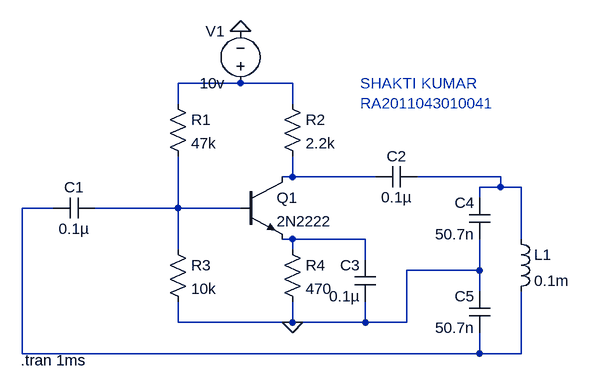
[diagram p0: schematic exp 8.asc]
exp 8.asc, the LTspice schematic file:
Version 4
SHEET 1 880 680
WIRE 192 0 96 0
WIRE 272 0 192 0
WIRE 96 32 96 0
WIRE 272 32 272 0
WIRE 272 144 272 112
WIRE 272 144 256 144
WIRE 400 144 272 144
WIRE 592 144 464 144
WIRE 592 160 592 144
WIRE 592 160 560 160
WIRE 624 160 592 160
WIRE 560 176 560 160
WIRE -96 192 -144 192
WIRE 96 192 96 112
WIRE 96 192 -32 192
WIRE 192 192 96 192
WIRE 272 240 256 240
WIRE 384 240 272 240
WIRE 624 240 624 160
WIRE 96 256 96 192
WIRE 272 256 272 240
WIRE 384 272 384 240
WIRE 560 288 560 240
WIRE 560 288 448 288
WIRE 560 320 560 288
WIRE 96 368 96 336
WIRE 272 368 272 336
WIRE 272 368 96 368
WIRE 384 368 384 336
WIRE 384 368 272 368
WIRE 448 368 448 288
WIRE 448 368 384 368
WIRE -144 416 -144 192
WIRE 560 416 560 384
WIRE 560 416 -144 416
WIRE 624 416 624 320
WIRE 624 416 560 416
FLAG 192 -80 0
FLAG 272 368 0
SYMBOL res 80 16 R0
SYMATTR InstName R1
SYMATTR Value 47k
SYMBOL res 256 16 R0
SYMATTR InstName R2
SYMATTR Value 2.2k
SYMBOL res 80 240 R0
SYMATTR InstName R3
SYMATTR Value 10k
SYMBOL res 256 240 R0
SYMATTR InstName R4
SYMATTR Value 470
SYMBOL npn 192 144 R0
SYMATTR InstName Q1
SYMATTR Value 2N2222
SYMBOL cap -32 176 R90
WINDOW 0 0 32 VBottom 2
WINDOW 3 32 32 VTop 2
SYMATTR InstName C1
SYMATTR Value 0.1µ
SYMBOL cap 464 128 R90
WINDOW 0 0 32 VBottom 2
WINDOW 3 32 32 VTop 2
SYMATTR InstName C2
SYMATTR Value 0.1µ
SYMBOL cap 400 336 R180
WINDOW 0 24 56 Left 2
WINDOW 3 24 8 Left 2
SYMATTR InstName C3
SYMATTR Value 0.1µ
SYMBOL cap 576 240 R180
WINDOW 0 24 56 Left 2
WINDOW 3 24 8 Left 2
SYMATTR InstName C4
SYMATTR Value 50.7n
SYMBOL cap 576 384 R180
WINDOW 0 24 56 Left 2
WINDOW 3 24 8 Left 2
SYMATTR InstName C5
SYMATTR Value 50.7n
SYMBOL ind 608 224 R0
SYMATTR InstName L1
SYMATTR Value 0.1m
SYMBOL voltage 192 16 R180
WINDOW 0 24 96 Left 2
WINDOW 3 24 16 Left 2
WINDOW 123 0 0 Left 0
WINDOW 39 0 0 Left 0
SYMATTR InstName V1
SYMATTR Value 10v
TEXT -146 426 Left 2 !.tran 1ms
TEXT 376 0 Left 2 ;SHAKTI KUMAR\nRA2011043010041

The netlist it stands for:
* exp 8.asc
R1 N001 N005 47k
R2 N001 N002 2.2k
R3 N005 0 10k
R4 N006 0 470
Q1 N002 N005 N006 0 2N2222
C1 N005 N004 0.1µ
C2 N003 N002 0.1µ
C3 0 N006 0.1µ
C4 0 N003 50.7n
C5 N004 0 50.7n
L1 N003 N004 0.1m
V1 N001 0 10v
.model NPN NPN
.model PNP PNP
.lib standard.bjt
.tran 1ms
* SHAKTI KUMAR
* RA2011043010041
.backanno
.end